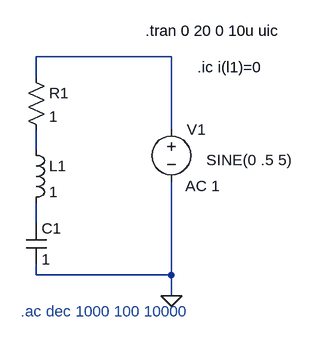
[diagram p0: schematic Draft1.asc]
Draft1.asc, the LTspice schematic file:
Version 4
SHEET 1 880 680
WIRE 432 16 224 16
WIRE 224 48 224 16
WIRE 432 128 432 16
WIRE 224 160 224 128
WIRE 224 272 224 240
WIRE 224 352 224 336
WIRE 432 352 432 208
WIRE 432 352 224 352
WIRE 432 384 432 352
FLAG 432 384 0
SYMBOL res 208 32 R0
SYMATTR InstName R1
SYMATTR Value 1
SYMBOL ind 208 144 R0
SYMATTR InstName L1
SYMATTR Value 1
SYMBOL cap 208 272 R0
SYMATTR InstName C1
SYMATTR Value 1
SYMBOL voltage 432 112 R0
WINDOW 123 22 103 Left 2
WINDOW 39 0 0 Left 0
WINDOW 3 54 63 Left 2
SYMATTR Value2 AC 1
SYMATTR Value SINE(0 .5 5)
SYMATTR InstName V1
TEXT 392 -24 Left 2 !.tran 0 20 0 10u uic
TEXT 200 408 Left 2 ;.ac dec 1000 100 10000
TEXT 472 32 Left 2 !.ic i(l1)=0

The netlist it stands for:
* Draft1.asc
R1 N001 N002 1
L1 N002 N003 1
C1 N003 0 1
V1 N001 0 SINE(0 .5 5) AC 1
.tran 0 20 0 10u uic
* .ac dec 1000 100 10000
.ic i(l1)=0
.backanno
.end